# Altium project E03_DAQ.PrjPcb
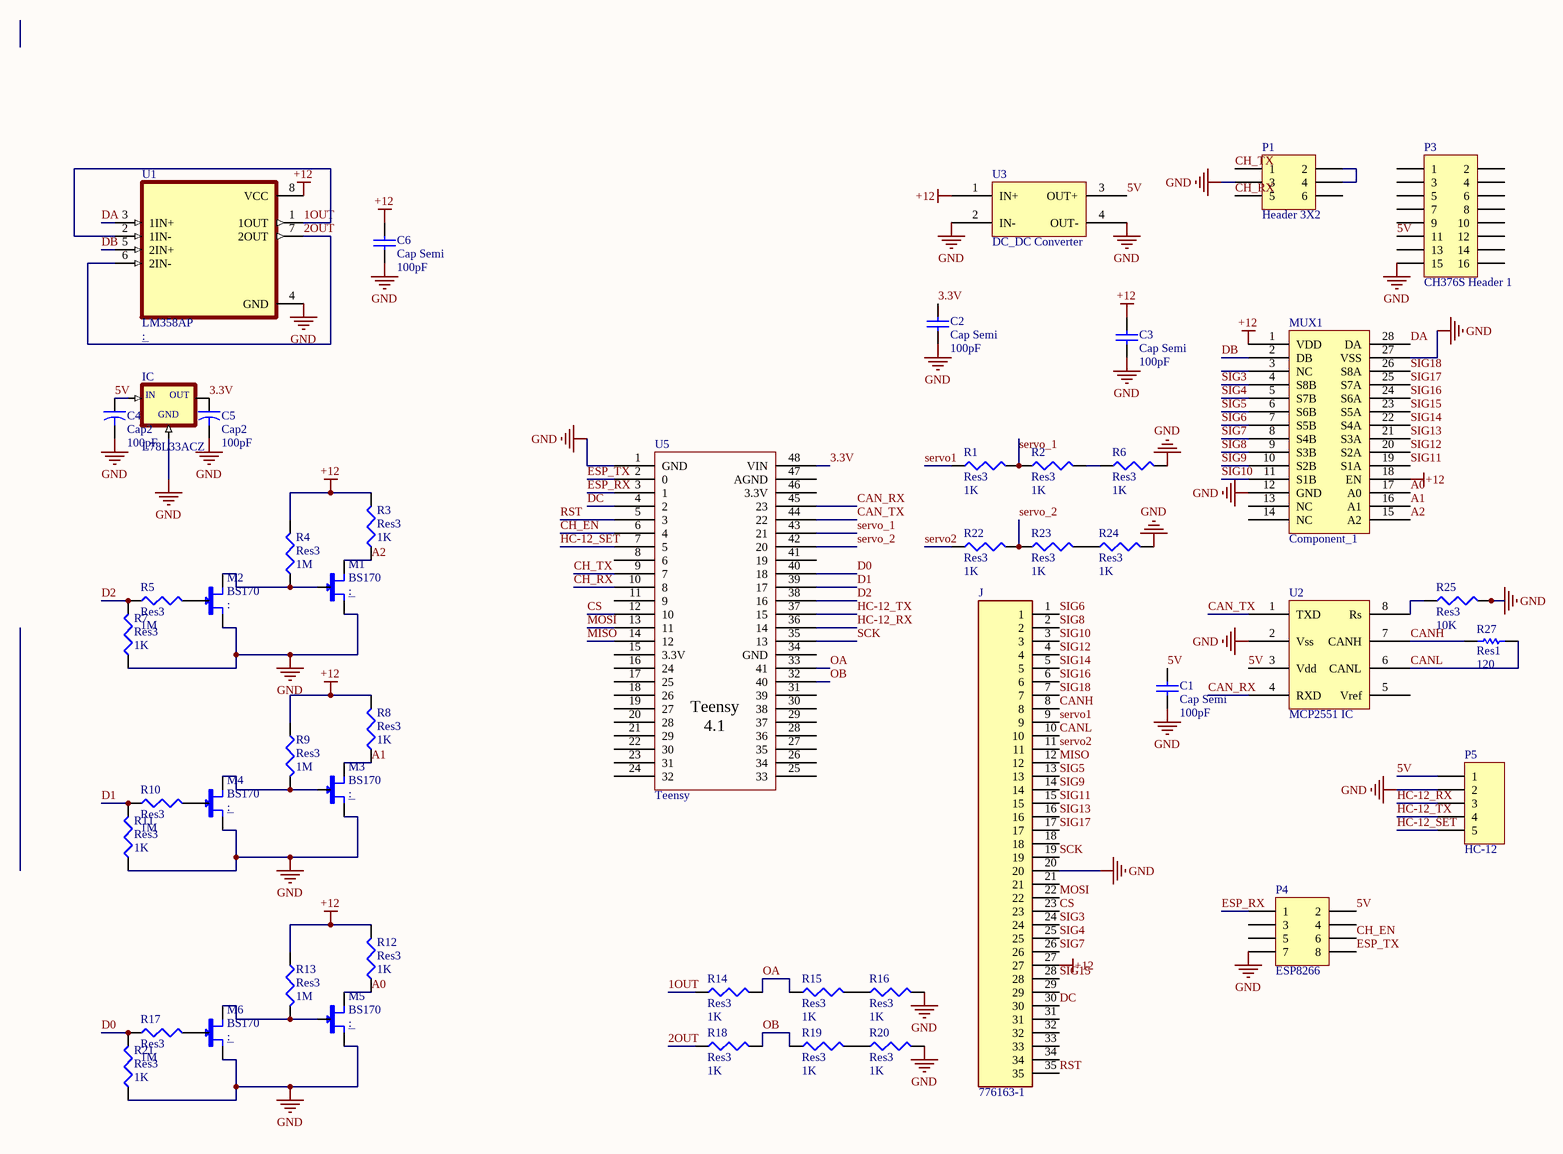
[diagram p0: E03_DAQ.SchDoc]
1 sheet, 49 parts. Net scope: global (net labels, ports and power ports of the same name join across sheets).
Board file: E03_DAQ.PcbDoc

## Sheet E03_DAQ.SchDoc
size A3

### Parts
C1  Cap Semi  value 100pF  [C1210]
C2  Cap Semi  value 100pF  [C1210]
C3  Cap Semi  value 100pF  [C1210]
C4  Cap2  value 100pF  [CAPR5-4X5]
C5  Cap2  value 100pF  [CAPR5-4X5]
C6  Cap Semi  value 100pF  [C1210]
IC  L78L33ACZ  [TO92]
J  776163-1  [TE_776163-1]
M1  BS170  [TRANSISTOR_TO-92]
M2  BS170  [TRANSISTOR_TO-92]
M3  BS170  [TRANSISTOR_TO-92]
M4  BS170  [TRANSISTOR_TO-92]
M5  BS170  [TRANSISTOR_TO-92]
M6  BS170  [TRANSISTOR_TO-92]
MUX1  Component_1  [*SOIC127P1030X265-28N]
P1  Header 3X2  [HDR2X3]
P3  CH376S Header 1  [HDR2X8]
P4  ESP8266  [HDR2X4]
P5  HC-12  [HDR1X5]
R1  Res3  value 1K  [14-1210]
R2  Res3  value 1K  [14-1210]
R3  Res3  value 1K  [14-1210]
R4  Res3  value 1M  [14-1210]
R5  Res3  value 1M  [14-1210]
R6  Res3  value 1K  [14-1210]
R7  Res3  value 1K  [14-1210]
R8  Res3  value 1K  [14-1210]
R9  Res3  value 1M  [14-1210]
R10  Res3  value 1M  [14-1210]
R11  Res3  value 1K  [14-1210]
R12  Res3  value 1K  [14-1210]
R13  Res3  value 1M  [14-1210]
R14  Res3  value 1K  [14-1210]
R15  Res3  value 1K  [14-1210]
R16  Res3  value 1K  [14-1210]
R17  Res3  value 1M  [14-1210]
R18  Res3  value 1K  [14-1210]
R19  Res3  value 1K  [14-1210]
R20  Res3  value 1K  [14-1210]
R21  Res3  value 1K  [14-1210]
R22  Res3  value 1K  [14-1210]
R23  Res3  value 1K  [14-1210]
R24  Res3  value 1K  [14-1210]
R25  Res3  value 10K  [14-1210]
R27  Res1  value 120  [AXIAL-0.3]
U1  LM358AP  [DIP794W45P254L959H508Q8]
U2  MCP2551 IC  [PCBComponent_1]
U3  DC_DC Converter  [PCBComponent_1]
U5  Teensy  [PCBComponent_1]

### Nets
+12: C3.2 C6.2 J.27 MUX1.1(VDD) MUX1.18(EN) R3.2 R4.2 R8.2 R9.1 R12.2 R13.1 U1.8(VCC) U3.1(IN+)
GND: C1.1 C2.1 C3.1 C4.2 C5.2 C6.1 IC.2(GND) J.20 M1.P$1(S) M2.P$1(S) M3.P$1(S) M4.P$1(S) M5.P$1(S) M6.P$1(S) MUX1.12(GND) MUX1.27(VSS) P1.3 P3.15 P4.7 P5.2 R6.2 R7.1 R11.1 R16.2 R20.2 R21.1 R24.2 R25.2 U1.4(GND) U2.2(Vss) U3.2(IN-) U3.4(OUT-) U5.1(GND)
1OUT: R14.1 U1.1(1OUT) U1.2(1IN-)
2OUT: R18.1 U1.6(2IN-) U1.7(2OUT)
3.3V: C2.2 C5.1 IC.1(OUT) U5.48(VIN)
5V: C1.2 C4.1 IC.3(IN) P3.11 P4.2 P5.1 U2.3(Vdd) U3.3(OUT+)
A0: M5.P$3(D) MUX1.17(A0) R12.1
A1: M3.P$3(D) MUX1.16(A1) R8.1
A2: M1.P$3(D) MUX1.15(A2) R3.1
CAN_RX: U2.4(RXD) U5.45(23)
CAN_TX: U2.1(TXD) U5.44(22)
CANH: J.8 R27.2 U2.7(CANH)
CANL: J.10 R27.1 U2.6(CANL)
CH_EN: P4.6 U5.6(4)
CH_RX: P1.5 U5.10(8)
CH_TX: P1.1 U5.9(7)
CS: J.23 U5.12(10)
D0: R17.1 R21.2 U5.40(18)
D1: R10.1 R11.2 U5.39(17)
D2: R5.1 R7.2 U5.38(16)
DA: MUX1.28(DA) U1.3(1IN+)
DB: MUX1.2(DB) U1.5(2IN+)
DC: J.30 U5.4(2)
ESP_RX: P4.1 U5.3(1)
ESP_TX: P4.8 U5.2(0)
HC-12_RX: P5.3 U5.36(14)
HC-12_SET: P5.5 U5.7(5)
HC-12_TX: P5.4 U5.37(15)
MISO: J.12 U5.14(12)
MOSI: J.22 U5.13(11)
OA: R14.2 R15.1 U5.33(41)
OB: R18.2 R19.1 U5.32(40)
RST: J.35 U5.5(3)
SCK: J.19 U5.35(13)
servo1: J.9 R1.1
servo2: J.11 R22.1
servo_1: R1.2 R2.1 U5.43(21)
servo_2: R22.2 R23.1 U5.42(20)
SIG3: J.24 MUX1.4(S8B)
SIG4: J.25 MUX1.5(S7B)
SIG5: J.13 MUX1.6(S6B)
SIG6: J.1 MUX1.7(S5B)
SIG7: J.26 MUX1.8(S4B)
SIG8: J.2 MUX1.9(S3B)
SIG9: J.14 MUX1.10(S2B)
SIG10: J.3 MUX1.11(S1B)
SIG11: J.15 MUX1.19(S1A)
SIG12: J.4 MUX1.20(S2A)
SIG13: J.16 MUX1.21(S3A)
SIG14: J.5 MUX1.22(S4A)
SIG15: J.28 MUX1.23(S5A)
SIG16: J.6 MUX1.24(S6A)
SIG17: J.17 MUX1.25(S7A)
SIG18: J.7 MUX1.26(S8A)
NetM1_P$2: M1.P$2(G) M2.P$3(D) R4.1
NetM2_P$2: M2.P$2(G) R5.2
NetM3_P$2: M3.P$2(G) M4.P$3(D) R9.2
NetM4_P$2: M4.P$2(G) R10.2
NetM5_P$2: M5.P$2(G) M6.P$3(D) R13.2
NetM6_P$2: M6.P$2(G) R17.2
NetP1_2: P1.2 P1.4
NetR2_2: R2.2 R6.1
NetR15_2: R15.2 R16.1
NetR19_2: R19.2 R20.1
NetR23_2: R23.2 R24.1
NetR25_1: R25.1 U2.8(Rs)

Not connected (* = marked no-connect by the designer): J 18 21 29 31 32 33 34; MUX1 3(NC) 13(NC) 14(NC); P1 6; P3 1 2 3 4 5 6 7 8 9 10 12 13 14 16; P4 3 4 5; U2 5(Vref); U5 8(6) 11(9) 15(3.3V) 16(24) 17(25) 18(26) 19(27) 20(28) 21(29) 22(30) 23(31) 24(32) 25(33) 26(34) 27(35) 28(36) 29(37) 30(38) 31(39) 34(GND) 41(19) 46(3.3V) 47(AGND)

### Library data of the parts
C1-C3 C6 = Cap Semi: Capacitor (Semiconductor SIM Model); Published: 8-Jun-2000; LatestRevisionDate: 29-May-2009; LatestRevisionNote: IPC-7351 Footprint Added.; PackageReference: C1206; Publisher: Altium Limited; PackageDescription: Chip Capacitor
C4 C5 = Cap2: Capacitor; Published: 23-Sep-2002; PackageReference: CAPR5-4X5; Publisher: Altium Limited; PackageDescription: Capacitor; 2 Leads
IC = L78L33ACZ: Linear Voltage Regulator IC 1 Output 100mA TO-92-3; MF: STMicroelectronics; Package: TO-92 STMicroelectronics; MP: L78L33ACZ; Value: *; Availability: Unavailable; SnapEDA_Link: https://www.snapeda.com/parts/L78L33ACZ/STMicroelectronics/view-part/50061/?ref=snap; Price: None
J = 776163-1: Rectangular Power Connector, AMPSEAL Series, Through Hole, Plug, 35, 4 mm, Pin; MF: TE Connectivity; TE_purchase_URL: https://www.te.com/usa-en/product-776163-1.html?te_bu=Cor&te_type=disp&te_campaign=seda_glo_cor-seda-global-disp-prtnr-fy19-seda-model-bom-cta_sma-317_1&elqCampaignId=32493; EU_RoHS_Compliance: Compliant; SnapEDA_Link: https://www.snapeda.com/parts/776163-1/TE%20Connectivity%20AMP%20Connectors/view-part/546665/?ref=snap; MP: 776163-1; Digi-Key_Purchase_URL: https://www.digikey.com/product-detail/en/te-connectivity-amp-connectors/776163-1/A106460-ND/2327364?utm_source=snapeda&utm_medium=aggregator&utm_campaign=symbol; Digi-Key_Part_Number: A106460-ND; Package: None; Value: *
M1-M6 = BS170: N-Channel 60V 500mA (Ta) 830mW (Ta) Through Hole TO-92-3; MF: ON Semiconductor; Arrow_Electronics-Purchase-URL: https://snapeda.com/shop?store=Arrow+Electronics&id=4775089; Price: None; Package: TO-92 ON Semiconductor; Value: *; MP: BS170; DigiKey-Purchase-URL: https://snapeda.com/shop?store=DigiKey&id=4775089; Availability: Good; Mouser-Purchase-URL: https://snapeda.com/shop?store=Mouser&id=4775089; SnapEDA_Link: https://www.snapeda.com/parts/BS170/ON%20Semiconductor/view-part/4775089/?ref=snap
P1 = Header 3X2: Header, 3-Pin, Dual row; LatestRevisionDate: 17-Jul-2002; LatestRevisionNote: Re-released for DXP Platform.; Publisher: Altium Limited
P3 = Header 8X2: Header, 8-Pin, Dual row; LatestRevisionDate: 17-Jul-2002; LatestRevisionNote: Re-released for DXP Platform.; Publisher: Altium Limited
P4 = Header 4X2: Header, 4-Pin, Dual row; LatestRevisionDate: 17-Jul-2002; LatestRevisionNote: Re-released for DXP Platform.; Publisher: Altium Limited
P5 = Header 5: Header, 5-Pin; LatestRevisionDate: 17-Jul-2002; LatestRevisionNote: Re-released for DXP Platform.; Publisher: Altium Limited
R1-R25 = Res3: Resistor; Published: 8-Jun-2000; LatestRevisionDate: 29-May-2009; LatestRevisionNote: IPC-7351 Footprint Added.; PackageReference: J1-0603; Publisher: Altium Limited; PackageDescription: Chip Resistor
R27 = Res1: Resistor; Published: 8-Jun-2000; LatestRevisionDate: 17-Jul-2002; LatestRevisionNote: Re-released for DXP Platform.; PackageReference: AXIAL-0.3; Publisher: Altium Limited; PackageDescription: Axial Device, Thru-Hole; 2 Leads; 0.3 in Pin Spacing
U1 = LM358AP: Dual improved offset, standard operational amplifier<br /> &nbsp; 8-PDIP 0 to 70; MF: Texas Instruments; Price: None; Value: *; Availability: Unavailable; SnapEDA_Link: https://www.snapeda.com/parts/LM358AP/Texas%20Instruments/view-part/214423/?ref=snap; MP: LM358AP; Texas_Instruments-Purchase-URL: https://snapeda.com/shop?store=Texas+Instruments&id=214423; Package: PDIP-8 Texas Instruments
U2 = MCP2551
U3 = LM2576
U5 = Teensy 4.1